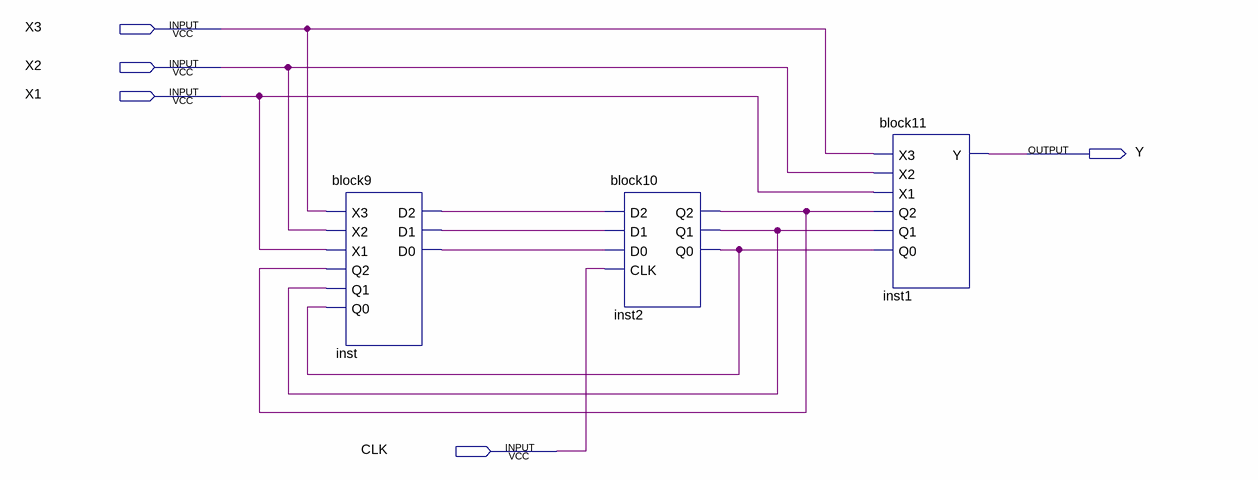
[diagram p0: schematic sheet]
// Quartus schematic block_cuoi.bdf as structural Verilog: 3 symbols, 5 pins
module block_cuoi (
  input  X3,
  input  X2,
  input  X1,
  input  CLK,
  output Y
);

  wire inst2_q0, inst2_q1, inst2_q2, inst_d0, inst_d1, inst_d2;

  block9 inst (
    .X3(X3), .X2(X2), .X1(X1), .Q2(inst2_q2), .Q1(inst2_q1), .Q0(inst2_q0), .D2(inst_d2), .D1(inst_d1),
    .D0(inst_d0));
  block10 inst2 (.D2(inst_d2), .D1(inst_d1), .D0(inst_d0), .CLK(CLK), .Q2(inst2_q2), .Q1(inst2_q1), .Q0(inst2_q0));
  block11 inst1 (.X3(X3), .X2(X2), .X1(X1), .Q2(inst2_q2), .Q1(inst2_q1), .Q0(inst2_q0), .Y(Y));
endmodule
